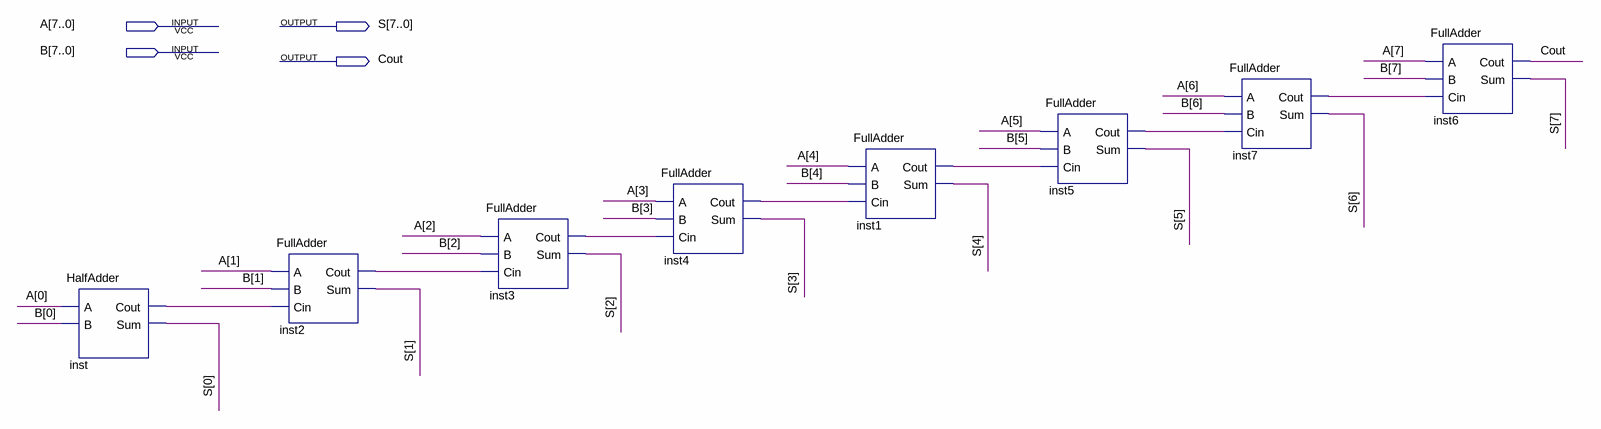
[diagram p0: schematic sheet]
// Quartus schematic RCA_8bits.bdf as structural Verilog: 8 symbols, 4 pins
module RCA_8bits (
  input  [7:0] A,
  input  [7:0] B,
  output [7:0] S,
  output Cout
);

  wire inst1_cout, inst2_cout, inst3_cout, inst4_cout, inst5_cout, inst7_cout, inst_cout;

  HalfAdder inst (.A(A[0]), .B(B[0]), .Cout(inst_cout), .Sum(S[0]));
  FullAdder inst2 (.A(A[1]), .B(B[1]), .Cin(inst_cout), .Cout(inst2_cout), .Sum(S[1]));
  FullAdder inst3 (.A(A[2]), .B(B[2]), .Cin(inst2_cout), .Cout(inst3_cout), .Sum(S[2]));
  FullAdder inst4 (.A(A[3]), .B(B[3]), .Cin(inst3_cout), .Cout(inst4_cout), .Sum(S[3]));
  FullAdder inst1 (.A(A[4]), .B(B[4]), .Cin(inst4_cout), .Cout(inst1_cout), .Sum(S[4]));
  FullAdder inst5 (.A(A[5]), .B(B[5]), .Cin(inst1_cout), .Cout(inst5_cout), .Sum(S[5]));
  FullAdder inst7 (.A(A[6]), .B(B[6]), .Cin(inst5_cout), .Cout(inst7_cout), .Sum(S[6]));
  FullAdder inst6 (.A(A[7]), .B(B[7]), .Cin(inst7_cout), .Cout(Cout), .Sum(S[7]));
endmodule
